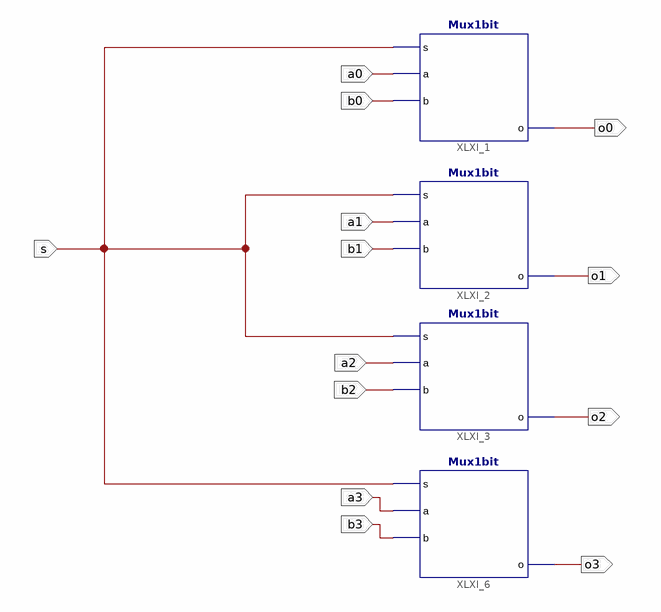
[diagram p0: schematic sheet 1]
// Xilinx ISE schematic Mux4bit.sch (spartan3e) as structural Verilog: 4 symbols, 13 ports
module Mux4bit (
  input  a0,
  input  b0,
  input  a1,
  input  b1,
  input  a2,
  input  b2,
  input  a3,
  input  b3,
  input  s,
  output o0,
  output o2,
  output o3,
  output o1
);

  Mux1bit XLXI_1 (.s(s), .a(a0), .b(b0), .o(o0));
  Mux1bit XLXI_2 (.s(s), .a(a1), .b(b1), .o(o1));
  Mux1bit XLXI_3 (.s(s), .a(a2), .b(b2), .o(o2));
  Mux1bit XLXI_6 (.s(s), .a(a3), .b(b3), .o(o3));
endmodule
